# EAGLE board zx80 SD_12 (smd) build006.7(STM32) (EAGLE 9.6.2), part 1 of 2
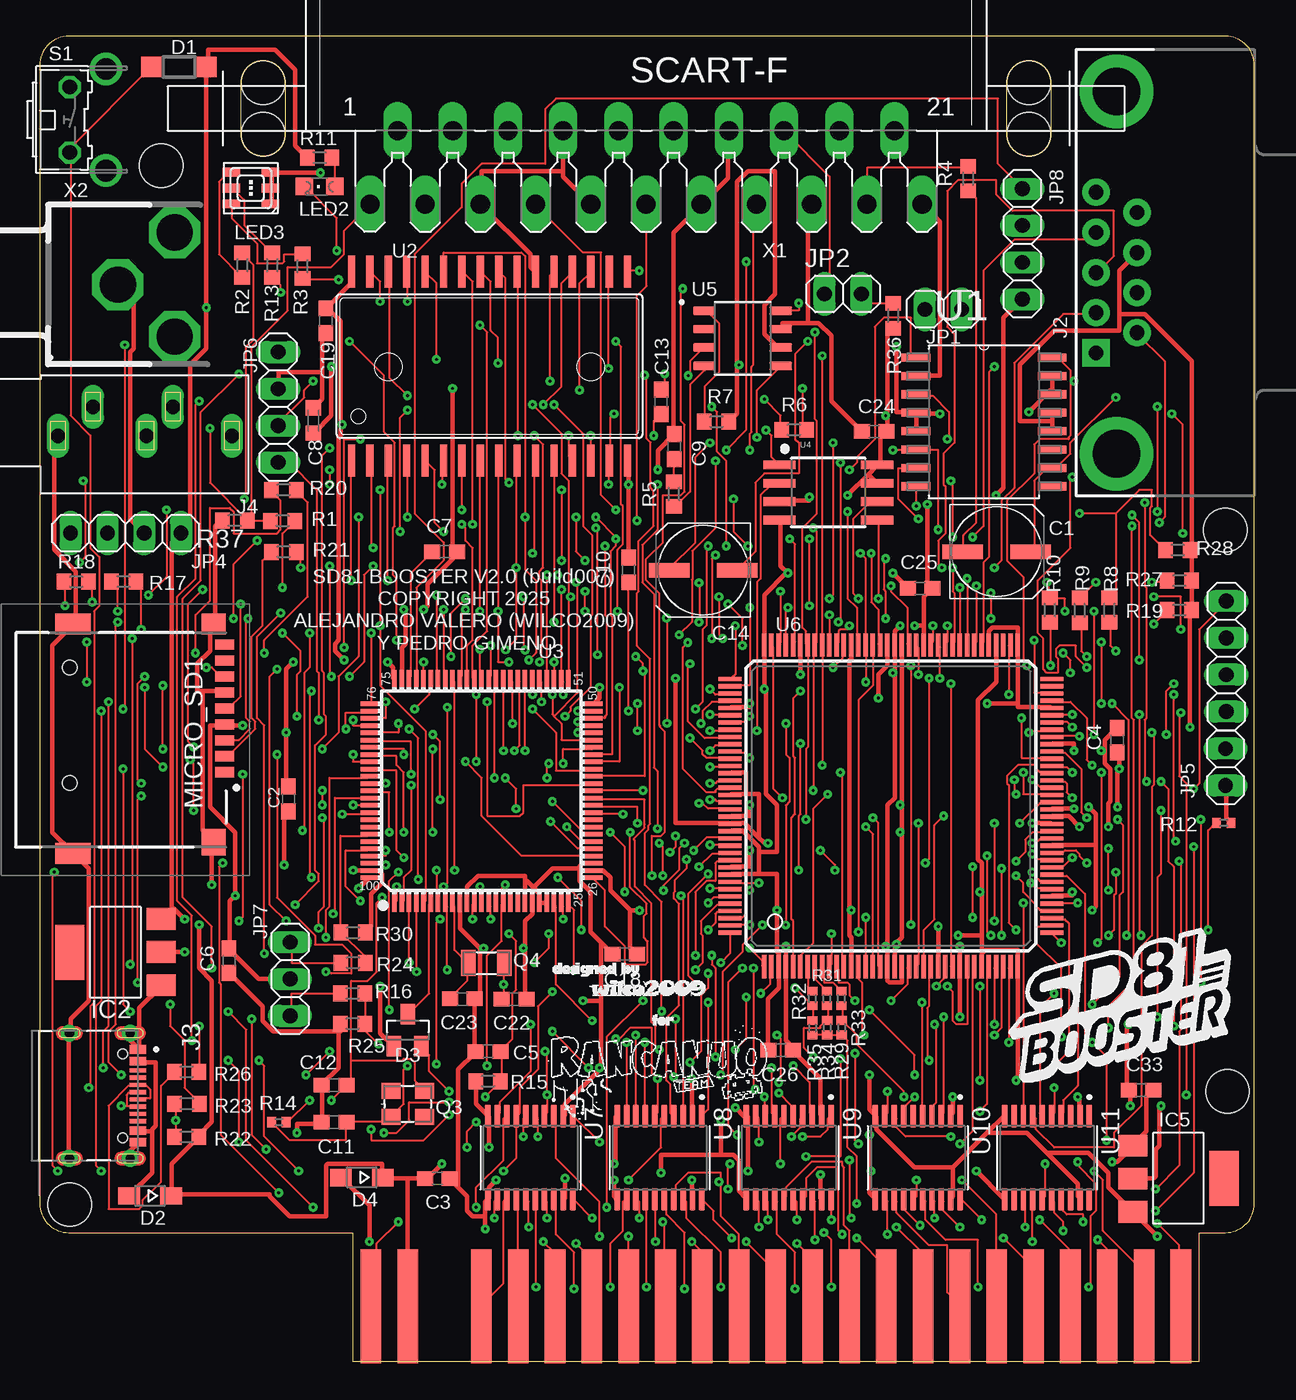
[diagram p3: board, top side]
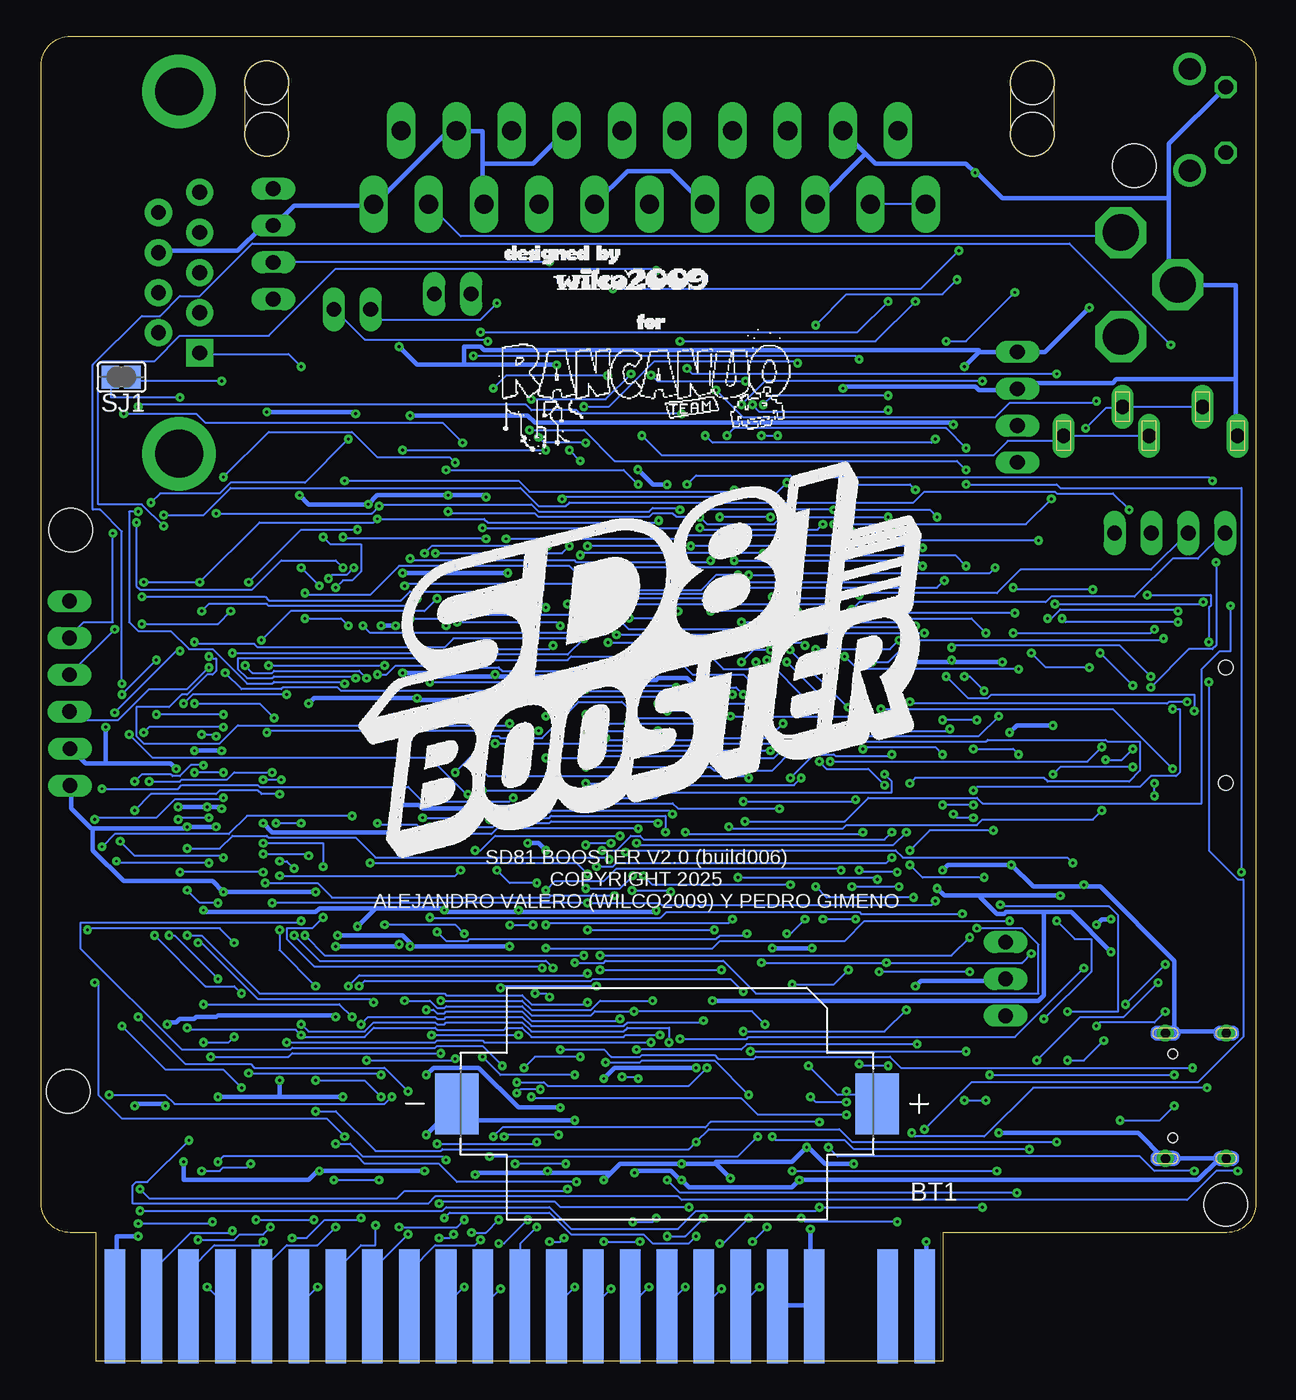
[diagram p4: board, bottom side, seen from below]

Size 83.82 x 91.44 mm. Coordinates in mm from the lower left corner, seen from the top.
Outline: 80.01,8.89 81.82,8.89 arc90 83.82,10.89 83.82,89.44 arc90 81.82,91.44 2,91.44 arc90 0,89.44 0,10.89 arc90 2,8.89 21.59,8.89 21.59,0 80.01,0 80.01,8.89
Copper layers (1*16): Top 0.035mm / dielectric 1.5mm / Bottom 0.035mm
Design rules "default *": minimum track width 5mil, minimum drill 0.2mm, track to track 5mil, track to pad 5mil, pad to pad 5mil, via to via 5mil, smd to smd 5mil, copper to edge 20mil, drill to drill 6mil, minimum pad ring 10mil, minimum via ring 8mil, stop-mask expansion 4mil, vias tented up to drill 999mil, thermal gap 10mil
Net classes: 1 VCC: width 0.3 mm; 2 3,3: width 0.3 mm
Holes 3 mm at 2.09,10.82 8.38,82.51 81.79,57.36 81.96,18.64

## Footprints (pad centres in the part's own frame; a part is rotated, then mirrored left to right if it is on the bottom)
EDGEPIN = smd 1.422 x 7.874: 1 0,0
BAT_CR2032-BS-6-1 = smd 3 x 4.2: N 14.5,0; P -14.5,0
UD-6,3X7,7_NICHICON = smd 2.8 x 1: + 2.35,0; - -2.35,0
C0603 = smd 1.1 x 1: 1 -0.85,0; 2 0.85,0
C0603K = smd 1.05 x 1.08: 1 -0.875,0; 2 0.875,0
SOD123 = smd 1.4 x 1.4: A 1.9,0; C -1.9,0
SOD323-W = smd 1.5 x 1.2: A 1.45,0; C -1.45,0
SOT23 = smd 1 x 1.4: 1 -0.95,-1.1; 2 0.95,-1.1; 3 0,1.1
SOT223 = smd 1.499 x 2.007: 1 -2.261,-3.15; 2 0.025,-3.15; 3 2.311,-3.15 | smd 3.81 x 2.007: 4 0,3.15
DB9_MALE = drill 1.016 pad 1.88 square: 1 5.54,-1.42 | drill 1.016 pad 1.88: 2 2.77,-1.42; 3 0,-1.42; 4 -2.77,-1.42; 5 -5.54,-1.42; 6 4.15,1.42; 7 1.38,1.42; 8 -1.38,1.42; 9 -4.15,1.42 | drill 3.302 pad 5.08: G1 -12.5,0; G2 12.5,0
SHOUHAN_TYPE-C_16PIN_2MD__073_ = smd 0.6 x 1.14: A1_B12 -3.2,3.675; A4_B9 -2.4,3.675; B1_A12 3.2,3.675; B4_A9 2.4,3.675 | smd 0.3 x 1.14: A5 -1.25,3.675; A6 -0.25,3.675; A7 0.25,3.675; A8 1.25,3.675; B5 1.75,3.675; B6 0.75,3.675; B7 -0.75,3.675; B8 -1.75,3.675 | drill 0.65 pad 0.95: SH1 -4.325,3.125; SH2 4.325,3.125; SH3 -4.325,-1.075; SH4 4.325,-1.075 | hole 0.65: -2.89,2.605; 2.89,2.605
XKB_PJ-325C5-G = drill 1 long: 1 0,-0.9; 2 2.4,1.1; 3 7.92,1.1; 4 12,-0.9; 5 6.1,-0.9
1X02 = drill 1.016 long: 1 -1.27,0; 2 1.27,0
1X04 = drill 1.016 long: 1 -3.81,0; 2 -1.27,0; 3 1.27,0; 4 3.81,0
1X03 = drill 1.016 long: 1 -2.54,0; 2 0,0; 3 2.54,0
CHIPLED_0805 = smd 1.2 x 1.2: A 0,-1.05; C 0,1.05
3535-PLCC6 = smd 1.2 x 0.6: P1 1.35,-1.1; P2 1.35,0; P3 1.35,1.1; P4 -1.35,1.1; P5 -1.35,0; P6 -1.35,-1.1
TF-01A = smd 0.7 x 1.3: 1 2.23,7.174; 2 1.13,7.174; 3 0.03,7.174; 4 -1.07,7.174; 5 -2.17,7.174; 6 -3.27,7.174; 7 -4.37,7.174; 8 -5.47,7.174; CD1 -6.57,7.174 | smd 1.448 x 1.651: MP1 -7.989,6.4 | smd 1.448 x 2.438: MP2 -7.989,-3.3; MP3 7.836,-3.3 | smd 1.854 x 1.651: MP4 7.061,6.4 | hole 1: -5.004,-3.531; 2.972,-3.531
3.2X2.5_KX-7 = smd 1.3 x 1.1: 1 -1.15,-0.9; 2 1.15,-0.9; 3 1.15,0.9; 4 -1.15,0.9
3.2X1.5 = smd 1 x 1.8: 1 -1.25,0; 2 1.25,0
R0603 = smd 1 x 1.1: 1 -0.85,0; 2 0.85,0
R0402 = smd 0.6 x 0.7: 1 -0.5,0; 2 0.5,0
B3F-31XX = drill 1.016 octagon: 1 -2.261,-1.245; 2 2.261,-1.245 | drill 1.499 pad 2.159: 3 -3.505,1.245; 4 3.505,1.245
SJ = smd 1.168 x 1.6: 1 -0.762,0; 2 0.762,0
SOIC127P1032X265-16N = smd 1.981 x 0.559: 1 -4.699,4.445; 2 -4.699,3.175; 3 -4.699,1.905; 4 -4.699,0.635; 5 -4.699,-0.635; 6 -4.699,-1.905; 7 -4.699,-3.175; 8 -4.699,-4.445; 9 4.699,-4.445; 10 4.699,-3.175; 11 4.699,-1.905; 12 4.699,-0.635; 13 4.699,0.635; 14 4.699,1.905; 15 4.699,3.175; 16 4.699,4.445
SOP32-5 = smd 2.2 x 0.5: 1 -6.516,9.525; 2 -6.516,8.255; 3 -6.516,6.985; 4 -6.516,5.715; 5 -6.516,4.445; 6 -6.516,3.175; 7 -6.516,1.905; 8 -6.516,0.635; 9 -6.516,-0.635; 10 -6.516,-1.905; 11 -6.516,-3.175; 12 -6.516,-4.445; 13 -6.516,-5.715; 14 -6.516,-6.985; 15 -6.516,-8.255; 16 -6.516,-9.525; 17 6.516,-9.525; 18 6.516,-8.255; 19 6.516,-6.985; 20 6.516,-5.715; 21 6.516,-4.445; 22 6.516,-3.175; 23 6.516,-1.905; 24 6.516,-0.635; 25 6.516,0.635; 26 6.516,1.905; 27 6.516,3.175; 28 6.516,4.445; 29 6.516,5.715; 30 6.516,6.985; 31 6.516,8.255; 32 6.516,9.525
LQFP100-0.5-13.8X13.8MM = smd 1.2 x 0.32: 1 -7.75,6; 2 -7.75,5.5; 3 -7.75,5; 4 -7.75,4.5; 5 -7.75,4; 6 -7.75,3.5; 7 -7.75,3; 8 -7.75,2.5; 9 -7.75,2; 10 -7.75,1.5; 11 -7.75,1; 12 -7.75,0.5; 13 -7.75,0; 14 -7.75,-0.5; 15 -7.75,-1; 16 -7.75,-1.5; 17 -7.75,-2; 18 -7.75,-2.5; 19 -7.75,-3; 20 -7.75,-3.5; 21 -7.75,-4; 22 -7.75,-4.5; 23 -7.75,-5; 24 -7.75,-5.5; 25 -7.75,-6; 51 7.75,-6; 52 7.75,-5.5; 53 7.75,-5; 54 7.75,-4.5; 55 7.75,-4; 56 7.75,-3.5; 57 7.75,-3; 58 7.75,-2.5; 59 7.75,-2; 60 7.75,-1.5; 61 7.75,-1; 62 7.75,-0.5; 63 7.75,0; 64 7.75,0.5; 65 7.75,1; 66 7.75,1.5; 67 7.75,2; 68 7.75,2.5; 69 7.75,3; 70 7.75,3.5; 71 7.75,4; 72 7.75,4.5; 73 7.75,5; 74 7.75,5.5; 75 7.75,6 | smd 0.32 x 1.2: 26 -6,-7.75; 27 -5.5,-7.75; 28 -5,-7.75; 29 -4.5,-7.75; 30 -4,-7.75; 31 -3.5,-7.75; 32 -3,-7.75; 33 -2.5,-7.75; 34 -2,-7.75; 35 -1.5,-7.75; 36 -1,-7.75; 37 -0.5,-7.75; 38 0,-7.75; 39 0.5,-7.75; 40 1,-7.75; 41 1.5,-7.75; 42 2,-7.75; 43 2.5,-7.75; 44 3,-7.75; 45 3.5,-7.75; 46 4,-7.75; 47 4.5,-7.75; 48 5,-7.75; 49 5.5,-7.75; 50 6,-7.75; 76 6,7.75; 77 5.5,7.75; 78 5,7.75; 79 4.5,7.75; 80 4,7.75; 81 3.5,7.75; 82 3,7.75; 83 2.5,7.75; 84 2,7.75; 85 1.5,7.75; 86 1,7.75; 87 0.5,7.75; 88 0,7.75; 89 -0.5,7.75; 90 -1,7.75; 91 -1.5,7.75; 92 -2,7.75; 93 -2.5,7.75; 94 -3,7.75; 95 -3.5,7.75; 96 -4,7.75; 97 -4.5,7.75; 98 -5,7.75; 99 -5.5,7.75; 100 -6,7.75
SO08-EIAJ = smd 0.61 x 2.21: 1 -1.905,-3.378; 2 -0.635,-3.378; 3 0.635,-3.378; 4 1.905,-3.378; 5 1.905,3.353; 6 0.635,3.353; 7 -0.635,3.353; 8 -1.905,3.353
SOIC127P600X170-8N = smd 1.58 x 0.59: 1 -2.625,1.905; 2 -2.625,0.635; 3 -2.625,-0.635; 4 -2.625,-1.905; 5 2.625,-1.905; 6 2.625,-0.635; 7 2.625,0.635; 8 2.625,1.905
TQ144 = smd 1.6 x 0.3: P1 -11.1,8.75; P2 -11.1,8.25; P3 -11.1,7.75; P4 -11.1,7.25; P5 -11.1,6.75; P6 -11.1,6.25; P7 -11.1,5.75; P8 -11.1,5.25; P9 -11.1,4.75; P10 -11.1,4.25; P11 -11.1,3.75; P12 -11.1,3.25; P13 -11.1,2.75; P14 -11.1,2.25; P15 -11.1,1.75; P16 -11.1,1.25; P17 -11.1,0.75; P18 -11.1,0.25; P19 -11.1,-0.25; P20 -11.1,-0.75; P21 -11.1,-1.25; P22 -11.1,-1.75; P23 -11.1,-2.25; P24 -11.1,-2.75; P25 -11.1,-3.25; P26 -11.1,-3.75; P27 -11.1,-4.25; P28 -11.1,-4.75; P29 -11.1,-5.25; P30 -11.1,-5.75; P31 -11.1,-6.25; P32 -11.1,-6.75; P33 -11.1,-7.25; P34 -11.1,-7.75; P35 -11.1,-8.25; P36 -11.1,-8.75; P73 11.1,-8.75; P74 11.1,-8.25; P75 11.1,-7.75; P76 11.1,-7.25; P77 11.1,-6.75; P78 11.1,-6.25; P79 11.1,-5.75; P80 11.1,-5.25; P81 11.1,-4.75; P82 11.1,-4.25; P83 11.1,-3.75; P84 11.1,-3.25; P85 11.1,-2.75; P86 11.1,-2.25; P87 11.1,-1.75; P88 11.1,-1.25; P89 11.1,-0.75; P90 11.1,-0.25; P91 11.1,0.25; P92 11.1,0.75; P93 11.1,1.25; P94 11.1,1.75; P95 11.1,2.25; P96 11.1,2.75; P97 11.1,3.25; P98 11.1,3.75; P99 11.1,4.25; P100 11.1,4.75; P101 11.1,5.25; P102 11.1,5.75; P103 11.1,6.25; P104 11.1,6.75; P105 11.1,7.25; P106 11.1,7.75; P107 11.1,8.25; P108 11.1,8.75 | smd 0.3 x 1.6: P37 -8.75,-11.1; P38 -8.25,-11.1; P39 -7.75,-11.1; P40 -7.25,-11.1; P41 -6.75,-11.1; P42 -6.25,-11.1; P43 -5.75,-11.1; P44 -5.25,-11.1; P45 -4.75,-11.1; P46 -4.25,-11.1; P47 -3.75,-11.1; P48 -3.25,-11.1; P49 -2.75,-11.1; P50 -2.25,-11.1; P51 -1.75,-11.1; P52 -1.25,-11.1; P53 -0.75,-11.1; P54 -0.25,-11.1; P55 0.25,-11.1; P56 0.75,-11.1; P57 1.25,-11.1; P58 1.75,-11.1; P59 2.25,-11.1; P60 2.75,-11.1; P61 3.25,-11.1; P62 3.75,-11.1; P63 4.25,-11.1; P64 4.75,-11.1; P65 5.25,-11.1; P66 5.75,-11.1; P67 6.25,-11.1; P68 6.75,-11.1; P69 7.25,-11.1; P70 7.75,-11.1; P71 8.25,-11.1; P72 8.75,-11.1; P109 8.75,11.1; P110 8.25,11.1; P111 7.75,11.1; P112 7.25,11.1; P113 6.75,11.1; P114 6.25,11.1; P115 5.75,11.1; P116 5.25,11.1; P117 4.75,11.1; P118 4.25,11.1; P119 3.75,11.1; P120 3.25,11.1; P121 2.75,11.1; P122 2.25,11.1; P123 1.75,11.1; P124 1.25,11.1; P125 0.75,11.1; P126 0.25,11.1; P127 -0.25,11.1; P128 -0.75,11.1; P129 -1.25,11.1; P130 -1.75,11.1; P131 -2.25,11.1; P132 -2.75,11.1; P133 -3.25,11.1; P134 -3.75,11.1; P135 -4.25,11.1; P136 -4.75,11.1; P137 -5.25,11.1; P138 -5.75,11.1; P139 -6.25,11.1; P140 -6.75,11.1; P141 -7.25,11.1; P142 -7.75,11.1; P143 -8.25,11.1; P144 -8.75,11.1
SOP65P640X120-20N = smd 1.57 x 0.41: 1 -2.87,2.925; 2 -2.87,2.275; 3 -2.87,1.625; 4 -2.87,0.975; 5 -2.87,0.325; 6 -2.87,-0.325; 7 -2.87,-0.975; 8 -2.87,-1.625; 9 -2.87,-2.275; 10 -2.87,-2.925; 11 2.87,-2.925; 12 2.87,-2.275; 13 2.87,-1.625; 14 2.87,-0.975; 15 2.87,-0.325; 16 2.87,0.325; 17 2.87,0.975; 18 2.87,1.625; 19 2.87,2.275; 20 2.87,2.925
SCART-F = drill 1.321 long: 1 19.05,5.08; 2 17.145,0; 3 15.24,5.08; 4 13.335,0; 5 11.43,5.08; 6 9.525,0; 7 7.62,5.08; 8 5.715,0; 9 3.81,5.08; 10 1.905,0; 11 0,5.08; 12 -1.905,0; 13 -3.81,5.08; 14 -5.715,0; 15 -7.62,5.08; 16 -9.525,0; 17 -11.43,5.08; 18 -13.335,0; 19 -15.24,5.08; 20 -17.145,0; 21 -19.05,5.08 | hole 3.023: 26.416,0.254; 26.416,-3.302; -26.416,0.254; -26.416,-3.302
3P = drill 2.5 pad 3.302 octagon: 1 -0.11,0; 2 3.81,3.595; 2@2 3.81,-3.595

## Placement (x,y rotation side)
1A  D7  [EDGEPIN]  22.86,3.81 0 top
1B  VCC  [EDGEPIN]  22.86,3.81 180 bottom
2A  /RAMCS  [EDGEPIN]  25.4,3.81 0 top
2B  9V  [EDGEPIN]  25.4,3.81 180 bottom
4A  D0  [EDGEPIN]  30.48,3.81 0 top
4B  GND  [EDGEPIN]  30.48,3.81 180 bottom
5A  D1  [EDGEPIN]  33.02,3.81 0 top
5B  GND  [EDGEPIN]  33.02,3.81 180 bottom
6A  D2  [EDGEPIN]  35.56,3.81 0 top
6B  /CLOCK  [EDGEPIN]  35.56,3.81 180 bottom
7A  D6  [EDGEPIN]  38.1,3.81 0 top
7B  A0  [EDGEPIN]  38.1,3.81 180 bottom
8A  D5  [EDGEPIN]  40.64,3.81 0 top
8B  A1  [EDGEPIN]  40.64,3.81 180 bottom
9A  D3  [EDGEPIN]  43.18,3.81 0 top
9B  A2  [EDGEPIN]  43.18,3.81 180 bottom
10A  D4  [EDGEPIN]  45.72,3.81 0 top
10B  A3  [EDGEPIN]  45.72,3.81 180 bottom
11A  A6  [EDGEPIN]  48.26,3.81 0 top
11B  A15  [EDGEPIN]  48.26,3.81 180 bottom
12A  /NMI  [EDGEPIN]  50.8,3.81 0 top
12B  A14  [EDGEPIN]  50.8,3.81 180 bottom
13A  /HALT  [EDGEPIN]  53.34,3.81 0 top
13B  A13  [EDGEPIN]  53.34,3.81 180 bottom
14A  /MREQ  [EDGEPIN]  55.88,3.81 0 top
14B  A12  [EDGEPIN]  55.88,3.81 180 bottom
15A  /IORQ  [EDGEPIN]  58.42,3.81 0 top
15B  A11  [EDGEPIN]  58.42,3.81 180 bottom
16A  /RD  [EDGEPIN]  60.96,3.81 0 top
16B  A10  [EDGEPIN]  60.96,3.81 180 bottom
17A  /WR  [EDGEPIN]  63.5,3.81 0 top
17B  A9  [EDGEPIN]  63.5,3.81 180 bottom
18A  /BUSAK  [EDGEPIN]  66.04,3.81 0 top
18B  A8  [EDGEPIN]  66.04,3.81 180 bottom
19A  /WAIT  [EDGEPIN]  68.58,3.81 0 top
19B  A7  [EDGEPIN]  68.58,3.81 180 bottom
20A  /BUSRQ  [EDGEPIN]  71.12,3.81 0 top
20B  A6  [EDGEPIN]  71.12,3.81 180 bottom
21A  /RESET  [EDGEPIN]  73.66,3.81 0 top
21B  A5  [EDGEPIN]  73.66,3.81 180 bottom
22A  /M1  [EDGEPIN]  76.2,3.81 0 top
22B  A4  [EDGEPIN]  76.2,3.81 180 bottom
23A  /RFSH  [EDGEPIN]  78.74,3.81 0 top
23B  /ROMCS  [EDGEPIN]  78.74,3.81 180 bottom
BT1  CR2032-BS-6-1  [BAT_CR2032-BS-6-1]  40.64,17.78 180 bottom
C1  220uF  [UD-6,3X7,7_NICHICON]  66.04,55.88 0 top
C2  100nF  [C0603]  17.17,38.81 270 top
C3  10uF  [C0603]  27.45,12.63 0 top
C4  100nF  [C0603]  74.34,42.86 90 top
C5  22pF  [C0603]  30.94,21.39 0 top
C6  10uF  [C0603]  13.07,27.66 270 top
C7  10uF  [C0603]  27.94,55.88 0 top
C8  100nF  [C0603K]  18.88,64.92 270 top
C9  1uF  [C0603]  43.78,63.12 270 top
C10  10uF  [C0603]  40.64,54.61 90 top
C11  22pF  [C0603]  20.32,16.51 0 top
C12  22pF  [C0603]  20.32,19.05 0 top
C13  1uF  [C0603]  42.87,66.22 90 top
C14  470uF  [UD-6,3X7,7_NICHICON]  45.79,54.6 180 top
C18  100nF  [C0603]  40.37,28.11 0 top
C19  100nF  [C0603]  19.75,71.81 270 top
C22  22pF  [C0603]  32.73,25 180 top
C23  22pF  [C0603]  29.16,25.02 180 top
C24  0.1uF  [C0603]  57.58,64.17 180 top
C25  0.1uF  [C0603]  60.76,53.34 180 top
C26  100nF  [C0603]  51.13,21.49 180 top
C33  10uF  [C0603]  76,18.71 0 top
D1  1n4148  [SOD123]  9.62,89.32 180 top
D2  1n5819  [SOD323-W]  7.62,11.43 180 top
D3  BAT54C  [SOT23]  25.4,22.86 0 top
D4  1n5819  [SOD323-W]  22.23,12.7 180 top
IC2  REG1117  [SOT223]  5.23,28.23 90 top
IC5  1.2V  [SOT223]  78.57,12.64 270 top
J2  JOYSTICK  [DB9_MALE]  74.31,75.13 270 top
J3  TYPE-C_16PIN_2MD__073_  [SHOUHAN_TYPE-C_16PIN_2MD__073_]  3.12,18.33 270 top
J4  PJ-325C5-G  [XKB_PJ-325C5-G]  1.27,64.77 0 top
JP1  SPEAKER  [1X02]  62.35,72.6 0 top
JP2  [1X02]  55.43,73.67 0 top
JP3  JTAG  [1X04]  81.88,48.65 90 top
JP4  SERIAL  [1X04]  5.94,57.16 180 top
JP5  VREF  [1X02]  81.83,41.01 90 top
JP6  PS2  [1X04]  16.46,65.84 270 top
JP7  BOOT  [1X03]  17.28,26.39 270 top
JP8  ST-LINK-V2  [1X04]  67.81,77.11 270 top
LED2  SD  [CHIPLED_0805]  19.33,81.06 90 top
LED3  STATUS  [3535-PLCC6]  14.57,80.96 0 top
MICRO_SD1  TF-01A  [TF-01A]  5.6,42.89 270 top
Q3  8MHz  [3.2X2.5_KX-7]  25.4,17.78 0 top
Q4  32767Hz  [3.2X1.5]  30.82,27.49 0 top
R1  300R  [R0603]  16.75,58 0 top
R2  150  [R0603]  13.98,75.64 270 top
R3  68  [R0603]  18.13,75.59 90 top
R4  75R  [R0603]  64.07,81.62 270 top
R5  100R  [R0603]  43.76,59.86 90 top
R6  100R  [R0603]  52.06,64.28 180 top
R7  10K  [R0603]  46.71,64.84 0 top
R8  270  [R0603]  73.8,51.86 270 top
R9  270  [R0603]  71.76,51.83 270 top
R10  270  [R0603]  69.69,51.85 270 top
R11  680  [R0603]  19.31,83.06 0 top
R12  2K  [R0402]  81.71,37.16 180 top
R13  150  [R0603]  16.05,75.63 90 top
R14  1M  [R0402]  16.51,16.51 0 top
R15  3k3  [R0603]  30.94,19.34 180 top
R16  510  [R0603]  21.59,25.4 0 top
R17  3k3  [R0603]  5.79,53.81 180 top
R18  3k3  [R0603]  2.52,53.8 0 top
R19  75R  [R0603]  78.63,51.84 0 top
R20  3k3  [R0603]  16.85,60.14 0 top
R21  3k3  [R0603]  16.85,55.86 180 top
R22  1K5  [R0603]  10.14,15.5 0 top
R23  22R  [R0603]  10.16,17.78 0 top
R24  510  [R0603]  21.63,27.51 180 top
R25  10K  [R0603]  21.6,23.3 0 top
R26  22R  [R0603]  10.13,19.98 0 top
R27  75R  [R0603]  78.63,53.88 0 top
R28  75R  [R0603]  78.54,55.98 0 top
R29  1K  [R0402]  55.32,25.04 270 top
R30  10K  [R0603]  21.63,29.59 180 top
R31  1K  [R0402]  54.32,25.04 270 top
R32  1K  [R0402]  53.32,25.04 270 top
R33  2K  [R0402]  55.34,23.03 90 top
R34  2K  [R0402]  54.34,23.03 90 top
R35  2K  [R0402]  53.33,23.01 90 top
R36  100R  [R0603]  58.89,72.15 270 top
R37  100R  [R0603]  13.47,58.03 180 top
S1  RESET  [B3F-31XX]  3.32,85.67 270 top
SJ1  [SJ]  78.28,67.92 180 bottom
U1  AD724  [SOIC127P1032X265-16N]  65.16,64.83 0 top
U2  AS6C4008  [SOP32-5]  31.04,68.68 90 top
U3  MCU-STM32F407VET6(LQFP100)  [LQFP100-0.5-13.8X13.8MM]  30.48,39.37 90 top
U4  25F32006WSOI  [SO08-EIAJ]  54.44,59.96 270 top
U5  PAM8302  [SOIC127P600X170-8N]  48.5,70.59 0 top
U6  XC6SLX9-2TQG144C  [TQ144]  58.74,38.34 90 top
U7  TXS0108EPWR  [SOP65P640X120-20N]  33.86,14.05 270 top
U8  TXS0108EPWR  [SOP65P640X120-20N]  42.77,14.05 270 top
U9  TXS0108EPWR  [SOP65P640X120-20N]  51.68,14.05 270 top
U10  TXS0108EPWR  [SOP65P640X120-20N]  60.59,14.05 270 top
U11  TXS0108EPWR  [SOP65P640X120-20N]  69.5,14.05 270 top
X1  SCART-F  [SCART-F]  41.84,84.93 180 top
X2  CON-CONRAD_736880-2P  [3P]  5.51,74.3 0 top

## Tracks (layer width: path | path; a pad name or v marks a point on that pad's centre or on a via)
1V2  (via drill 0.2)
  Top 0.3: v75.25,17.64 75.25,18.64 C33.1 75.12,18.77 75,18.77 75,23.14 v75.12,23.27 | v77.38,17.64 77.25,17.52 77.25,14.89 77,14.64 77,12.77 76.88,12.64 75.5,12.64 IC5.2 | 59.5,36.52 59.5,29.27 59.06,28.83 | 59.5,36.52 59.5,38.39 | 59.5,38.39 59.5,49.39 U6.P89 | 59.06,28.83 59,28.77 59,27.27 U6.P19 | v49,38.39 49,37.64 47.75,37.64 U6.P128 | v59.38,38.39 59.5,38.39 | v63.5,28.64 63.5,27.27 U6.P28 63.5,27.14 v63.5,23.77 | v59.12,28.77 59.06,28.83 | v68.5,37.14 69.75,37.14 U6.P52 | v59.38,36.52 59.5,36.52
  Bottom 0.3: v75.25,17.64 75.38,17.77 77.25,17.77 v77.38,17.64 | v49,38.39 49.12,38.27 54.25,38.27 54.38,38.14 57.5,38.14 57.75,38.39 v59.38,38.39 | v63.5,28.64 59.25,28.64 v59.12,28.77 | v68.5,37.14 67.88,36.52 v59.38,36.52 | v75.12,23.27 75,23.39 74.5,23.39 74.25,23.64 73.25,23.64 73.12,23.77 71.75,23.77 71.62,23.89 63.62,23.89 v63.5,23.77
3V3  (via drill 0.2)
  Top 0.3: U3.22 34.88,31.64 34.5,31.64 U3.21 34.5,31.77 34.5,32.27 34.06,32.7 | 33.5,33.14 33.5,31.64 U3.19 | 33.5,33.14 33.5,33.52 30.25,33.52 29.5,32.77 29.5,31.64 U3.11 | 34.06,32.7 33.62,33.14 33.5,33.14 | 38.81,28.83 38,29.64 38,32.39 37.25,33.14 37.25,34.02 | 38.81,28.83 39.5,28.14 C18.1 | 37.25,34.02 37.25,34.14 37.5,34.39 38.12,34.39 U3.28 | 38.69,20.2 38.75,20.27 38.75,24.89 | 38.69,20.2 36.25,17.77 36.25,17.02 U7.2 | 38.75,24.89 38.75,28.77 38.81,28.83 | v45,19.52 45,17.02 U8.2 | v38.62,20.27 38.69,20.2 | 34.06,32.7 35.38,34.02 37.25,34.02 | 20.75,64.64 20.75,63.89 20.62,63.77 20.62,49.77 20.38,49.52 20.38,49.02 v21,48.39 | 20.75,64.64 20.75,71.77 19.88,72.64 C19.1 21.52,74.42 U2.32 | v24,48.27 24.38,47.89 24.38,47.14 U3.75 | v14,43.89 12.88,43.89 MICRO_SD1.4 12.75,43.89 11.75,43.89 11.75,38.27 13.5,36.52 v13.5,32.14 13.12,31.77 13.12,28.64 C6.1 13.12,28.39 15.12,26.39 17.25,26.39 JP7.2 | C2.1 17.12,39.77 17,39.89 v17,43.39 17,47.77 v17.5,48.27 | v22,32.64 U3.100 | v23.5,25.89 23.5,22.64 24.38,21.77 D3.1 | v10,28.27 8.5,28.27 IC2.2 | v37.5,24.89 38.75,24.89 | R12.1 82.12,37.27 81.88,37.52 81.88,39.64 JP5.1 | 73.5,42.14 73.5,41.27 73.88,40.89 73.88,38.64 73.75,38.52 v73.75,36.89 | 73.5,42.14 73.5,42.89 74.25,43.64 C4.2 | v71.25,32.39 71.25,32.14 69.88,32.14 U6.P42 | v71.75,36.89 71,37.64 69.88,37.64 U6.P53 | v71.38,42.14 71.38,42.64 69.88,42.64 U6.P63 | v73.25,42.14 73.5,42.14 | v63,18.27 63,17.14 62.88,17.02 U10.2 | v71.62,18.27 71.75,18.14 71.75,17.02 U11.2 | 65,28.14 65,27.27 U6.P31 | 65,28.14 65.25,28.39 67.5,28.39 67.5,27.27 U6.P36 67.5,27.14 67.5,19.52 v67.38,19.39 | 65,28.14 65,29.39
  Top 0.3: 65,29.39 65,32.39 | 65,32.39 65,34.39 64.75,34.64 64.75,45.64 66,46.89 66,49.39 U6.P76 | v64.88,32.39 65,32.39 | 61,50.77 61,49.52 U6.P86 | 61,50.77 61,52.77 61.5,53.27 C25.1 61.5,53.39 61.25,53.64 v61.25,59.14 | 58.5,65.27 58.5,64.27 C24.1 58.38,64.14 58,63.77 58,62.02 57.88,61.89 U4.8 57.75,61.77 57.19,61.2 | 58.5,65.27 58.5,70.89 58.88,71.27 R36.2 | v53.12,59.64 53.12,59.39 51.12,59.39 U4.3 | 57.19,61.2 v55.75,59.77 | 57.19,61.2 57.75,60.64 U4.7 | v66,59.77 66.5,60.27 66.5,72.02 67.75,73.27 JP8.4 | v49,35.27 49,34.14 47.75,34.14 U6.P135 | v50.25,35.77 50,35.77 49.56,36.2 | 49.56,36.2 48.62,37.14 47.75,37.14 U6.P129 47.5,37.14 43.88,37.14 v43.88,47.14 | 48.75,39.14 49.62,39.14 49.62,36.27 49.56,36.2 | 48.75,39.14 47.75,39.14 U6.P125 | 48.75,39.14 48.75,40.64 47.75,40.64 U6.P122 | U3.50 38.62,45.77 v38.62,46.52 | v52.5,47.39 52.5,49.39 U6.P103 | U9.2 53.88,17.02 53.88,19.52 52,21.39 C26.1 52,21.64 51.5,22.14 51.5,27.14 U6.P4 51.5,27.39 v51.5,28.64 | U6.P20 59.5,27.14 59.5,26.14 58.62,26.14 58.5,26.27 58.5,27.14 U6.P18 58.5,27.39 58.5,28.64 | 59,47.52 59,38.89 58.5,38.39 58.5,28.64 | 59,47.52 59,49.39 U6.P90 59,49.52 59,50.39 v59.38,50.77 | v58.38,28.64 58.5,28.64 | v58.88,47.52 59,47.52 | v60.38,50.77 61,50.77 | v63.38,29.39 65,29.39 | v20.88,64.64 20.75,64.64 | v58.38,65.27 58.5,65.27
  Bottom 0.3: v45,19.52 44.25,20.27 v38.62,20.27 | v24,48.27 21.12,48.27 v21,48.39 20.88,48.39 20.75,48.27 v17.5,48.27 | v17,43.39 16.5,43.89 v14,43.89 | v22,32.64 21.5,32.14 19,32.14 | v13.5,32.14 19,32.14 | v23.5,25.89 23.12,26.27 17.38,26.27 JP7.2 | v10,28.27 12.75,31.02 14.62,31.02 | 14.62,31.02 17.25,31.02 17.38,30.89 17.88,30.89 19,32.02 19,32.14 | v37.5,24.89 15,24.89 14.62,25.27 14.62,31.02 | 80.25,36.77 80.38,36.77 81.75,38.14 81.75,39.64 JP5.1 | 80.25,36.77 73.88,36.77 v73.75,36.89 v71.75,36.89 | 80.25,36.77 80.25,35.27 78.12,33.14 72,33.14 v71.25,32.39 v64.88,32.39 | v73.25,42.14 v71.38,42.14 | v71.62,18.27 67.38,18.27 | 67.38,18.27 v63,18.27 | v67.38,19.39 67.38,18.27 | v53.12,59.64 53.25,59.77 v55.75,59.77 60.62,59.77 v61.25,59.14 65.38,59.14 v66,59.77 | v49,35.27 49.5,35.77 v50.25,35.77 | v38.62,46.52 39.25,47.14 41.25,47.14 41.38,47.02 43.88,47.02 | 43.88,47.02 45.62,47.02 45.88,47.27 52.38,47.27 v52.5,47.39 52.62,47.39 52.75,47.27 56.5,47.27 56.75,47.52 v58.88,47.52 | v43.88,47.14 43.88,47.02 | v51.5,28.64 v58.38,28.64 58.25,28.77 58.88,29.39 v63.38,29.39 | v59.38,50.77 v60.38,50.77 | v20.88,64.64 21,64.77 49.75,64.77 50.25,65.27 v58.38,65.27
/BUSAK_5  (via drill 0.2)
  Top 0.127: v60.5,12.52 60.5,11.39 60.38,11.27 U10.15 | v63.62,12.52 66,10.14 66,3.89 18A.1
  Bottom 0.127: v63.62,12.52 v60.5,12.52
/BUSRQ_5  (via drill 0.2)
  Top 0.127: v65,9.77 63.62,11.14 U10.20 | v69,9.77 71,7.77 71,3.89 20A.1
  Bottom 0.127: v69,9.77 v65,9.77
/CLOCK  (via drill 0.2)
  Top 0.127: v34.38,15.52 34.38,16.77 34.25,16.89 U7.5 | v52.88,14.14 55.25,14.14 v55.25,20.89 | v61.38,20.77 61.25,20.89 61.25,24.39 61.38,24.52 61.38,27.14 U6.P24
  Bottom 0.127: v34.38,15.52 35.75,14.14 v52.88,14.14 | v55.25,20.89 55.38,20.77 v61.38,20.77
/CLOCK_5  (via drill 0.2)
  Top 0.127: v34.25,5.14 34.25,11.14 U7.16
  Bottom 0.127: v34.25,5.14 35.5,3.89 6B.1
/HALT  (via drill 0.2)
  Top 0.127: v50,18.27 50,17.02 U9.8 | v28.25,17.02 26.5,15.27 22.88,15.27 v22.88,16.02 | v3.25,49.64 v3.25,46.89 | v7.5,52.89 8.75,54.14 v8.75,58.77 | v75.38,58.39 75.88,57.89 v75.88,48.39 | v78.25,46.02 78.25,36.02 v78.38,35.89 | v71.25,34.77 70.62,34.14 69.88,34.14 U6.P46
  Bottom 0.127: v50,18.27 49.88,18.14 35.5,18.14 34.38,17.02 v28.25,17.02 | v22.88,16.02 19.62,19.27 4,19.27 0.88,22.39 0.88,33.27 1.25,33.27 3.25,35.27 v3.25,46.89 | v3.25,49.64 3.25,52.02 3.12,52.14 3.12,52.89 v7.5,52.89 | v8.75,58.77 9.88,59.89 13.75,59.89 13.88,60.02 22.88,60.02 23.62,59.27 47.38,59.27 47.62,59.02 49.5,59.02 50.75,60.27 70.75,60.27 72.62,58.39 v75.38,58.39 | v78.25,46.02 v75.88,48.39 | v78.38,35.89 77.38,34.89 71.38,34.89 v71.25,34.77
/HALT_5  (via drill 0.2)
  Top 0.127: v50.25,9.77 50.25,11.02 50.12,11.14 U9.13 | v52.25,8.14 53.25,7.14 53.25,3.89 13A.1
  Bottom 0.127: v50.25,9.77 51.88,8.14 v52.25,8.14
/IORQ  (via drill 0.2)
  Top 0.127: v51.88,15.52 52.5,16.14 52.5,16.77 52.62,16.89 U9.4 | v48.12,15.64 47.5,16.27 47.5,26.14 v48.5,27.14 | v66.38,34.02 v66.38,29.39 | v67.38,34.52 68,35.14 68,36.02 68.5,36.52 69.75,36.52 U6.P51
  Bottom 0.127: v51.88,15.52 51.75,15.64 v48.12,15.64 | v48.5,27.14 49,27.64 64.62,27.64 v66.38,29.39 | v66.38,34.02 66.88,34.52 v67.38,34.52
/IORQ_5  (via drill 0.2)
  Top 0.127: v55.38,8.77 55.12,9.02 55.12,13.39 53.62,13.39 52.88,12.64 52.88,11.39 52.75,11.27 U9.17 | v56.38,8.52 58.38,6.52 58.38,3.89 15A.1
  Bottom 0.127: v55.38,8.77 55.62,8.52 v56.38,8.52
/M1  (via drill 0.2)
  Top 0.127: v70,25.39 69,24.39 69,17.14 69.12,17.02 U11.6 | v76,29.39 75.88,29.52 v75.88,44.64 | v71.25,44.64 69.88,44.64 U6.P67
  Bottom 0.127: v70,25.39 70.5,25.89 72.5,25.89 v76,29.39 | v71.25,44.64 v75.88,44.64
/M1_5  (via drill 0.2)
  Top 0.127: v69.38,13.64 69.38,11.39 69.25,11.27 U11.15 | v72.75,13.14 73.38,12.52 73.38,9.02 76.12,6.27 76.12,3.89 22A.1
  Bottom 0.127: v69.38,13.64 69.62,13.39 71.25,13.39 71.5,13.14 v72.75,13.14
/MEM_OE  (via drill 0.2)
  Top 0.127: v57.38,55.77 57.38,52.39 57.88,51.89 57.88,49.52 U6.P92 | v48.88,56.27 47.88,57.27 v47.88,59.52 | v32.38,60.64 32.12,60.89 32.12,74.77 31.75,75.14 U2.24
  Bottom 0.127: v57.38,55.77 56.88,56.27 v48.88,56.27 | v47.88,59.52 47.75,59.64 33.38,59.64 v32.38,60.64
/MREQ  (via drill 0.2)
  Top 0.127: v51.12,13.64 51.12,16.77 51.25,16.89 U9.6 | v47.62,13.64 47.5,13.52 v47.5,11.89 | v77,11.89 78.62,13.52 78.62,22.77 78.75,22.89 78.75,34.39 v78.62,34.52 | v72.25,34.39 71.75,34.89 71.75,35.02 71.5,35.27 70.75,35.27 70.62,35.14 69.88,35.14 U6.P48
  Bottom 0.127: v47.62,13.64 v51.12,13.64 | v47.5,11.89 47.62,11.77 58.75,11.77 59.25,11.27 76.38,11.27 v77,11.89 | v78.62,34.52 78.5,34.39 v72.25,34.39
/MREQ_5
  Top 0.127: U9.15 51.38,11.27 51.5,11.39 51.5,12.02 53.25,13.77 55.38,13.77 55.38,13.52 55.5,13.39 55.5,9.39 55.88,9.02 55.88,3.89 14A.1
/NMI  (via drill 0.2)
  Top 0.127: v46.12,24.77 46.12,17.39 45.75,17.02 U8.1 | v73.75,29.39 74.12,29.77 74.12,32.14 74.25,32.27 v74.25,33.77 | v68.5,33.77 68.75,33.52 68.75,33.39 69,33.14 69.75,33.14 U6.P44
  Bottom 0.127: v46.12,24.77 46.25,24.64 50,24.64 50.62,25.27 55.88,25.27 56,25.39 68.75,25.39 72.75,29.39 v73.75,29.39 | v68.5,33.77 v74.25,33.77
/NMI_5  (via drill 0.2)
  Top 0.127: v47.75,8.52 46.5,9.77 46.5,10.39 45.75,11.14 U8.20 | v48.75,8.27 50.75,6.27 50.75,3.89 12A.1
  Bottom 0.127: v47.75,8.52 48,8.27 v48.75,8.27
/OE_OL  (via drill 0.2)
  Top 0.127: v37.12,44.14 37.12,43.89 38.12,43.89 U3.47 | v55.25,40.64 55.38,40.52 55.38,27.27 U6.P12
  Bottom 0.127: v37.12,44.14 37.38,44.39 42.62,44.39 43.75,45.52 46.75,45.52 49.25,43.02 52.12,43.02 52.25,43.14 52.75,43.14 v55.25,40.64
/RD  (via drill 0.2)
  Top 0.127: v52.62,15.52 53.88,15.52 54.38,16.02 54.38,16.77 54.5,16.89 U9.1 | v30.12,16.52 29.5,15.89 v29.5,14.77 | v4.25,13.14 3.88,13.52 3.88,24.52 4.25,24.89 v4.25,44.89 | v21.38,47.27 22.38,48.27 22.38,54.27 v23,54.89 | v36,60.14 v36,55.27 | v62.88,60.77 63,60.64 v63,56.89 | v53.12,52.14 v53.12,56.77 | v51.62,52.02 51.5,51.89 51.5,49.52 U6.P105
  Bottom 0.127: v52.62,15.52 52,16.14 38,16.14 37.62,16.52 v30.12,16.52 | v29.5,14.77 28.88,14.14 8,14.14 7,13.14 v4.25,13.14 | v4.25,44.89 4.25,46.02 18.25,46.02 18.5,45.77 19.88,45.77 v21.38,47.27 | v23,54.89 23.38,55.27 v36,55.27 | v36,60.14 36.12,60.02 50.12,60.02 50.88,60.77 v62.88,60.77 | v63,56.89 62.88,56.77 v53.12,56.77 | v53.12,52.14 53,52.02 v51.62,52.02
/RD_5  (via drill 0.2)
  Top 0.127: v54.62,9.77 54.62,11.14 U9.20 | v59.12,9.27 60.88,7.52 60.88,3.89 16A.1
  Bottom 0.127: v54.62,9.77 55.12,9.27 v59.12,9.27
/RESET  (via drill 0.2)
  Top 0.127: v22.12,31.77 21.12,32.77 21.12,35.27 22.62,35.27 U3.96 | v46.12,31.64 46.5,32.02 47.62,32.02 U6.P139 | v67.88,31.64 67.88,17.02 U11.8
  Bottom 0.127: v22.12,31.77 22.38,31.52 41.02,31.52 41.15,31.64 v46.12,31.64 v67.88,31.64
/RESET_5  (via drill 0.2)
  Top 0.127: v68,9.27 68,11.14 U11.13 | v73,8.39 73.62,7.77 73.62,3.89 21A.1
  Bottom 0.127: v68,9.27 68.5,8.77 70.12,8.77 70.5,8.39 v73,8.39
/RFSH  (via drill 0.2)
  Top 0.127: v71.62,26.39 71.62,19.02 70.62,18.02 70.62,17.14 70.5,17.02 U11.4 | v75,29.39 75.12,29.52 75.12,44.27 v74,45.39 | v66.88,46.02 66.88,49.39 U6.P74
  Bottom 0.127: v71.62,26.39 74.62,29.39 v75,29.39 | v74,45.39 73.38,46.02 v66.88,46.02
/RFSH_5  (via drill 0.2)
  Top 0.127: v72,9.64 72,10.14 70.88,10.14 70.62,10.39 70.62,11.02 70.5,11.14 U11.17 | v77.12,9.52 78.62,8.02 78.62,3.89 23A.1
  Bottom 0.127: v72,9.64 72.12,9.52 v77.12,9.52
/WAIT  (via drill 0.2)
  Top 0.127: v38.12,23.52 35.62,26.02 35.62,31.39 35.5,31.52 U3.23 | v61.75,23.27 61.88,23.14 61.88,17.89 61.62,17.64 61.62,17.02 U10.4
  Bottom 0.127: v38.12,23.52 38.25,23.39 43.38,23.39 43.62,23.14 50,23.14 50.62,23.77 55.88,23.77 56,23.64 56.5,23.64 56.62,23.77 61.25,23.77 v61.75,23.27
/WAIT_5  (via drill 0.2)
  Top 0.127: v61.75,9.89 61.75,11.02 61.62,11.14 U10.17 | v66.5,8.52 68.5,6.52 68.5,3.89 19A.1
  Bottom 0.127: v61.75,9.89 61.88,9.77 64.25,9.77 65.5,8.52 v66.5,8.52
/WR  (via drill 0.2)
  Top 0.127: v62.88,15.52 59.75,15.52 59.12,16.14 59.12,16.77 59,16.89 U10.8 | v80.12,37.39 v80.12,26.14 | v71.25,38.89 70.88,39.27 70.88,39.89 70.75,40.02 69.88,40.02 U6.P58
  Bottom 0.127: v62.88,15.52 64.12,16.77 78.25,16.77 79.88,18.39 79.88,26.14 v80.12,26.14 | v80.12,37.39 80,37.52 75.88,37.52 74.62,38.77 71.38,38.77 v71.25,38.89
/WR'  (via drill 0.2)
  Top 0.127: v52.88,37.39 52.88,42.27 53,42.39 53,49.39 U6.P102 52.88,49.52 52.88,50.39 52.62,50.64 52.62,57.52 53.62,58.52 53.62,64.89 53.5,65.02 v53.5,71.02 | U3.26 38.25,33.27 39,32.52 39,30.02 40.38,28.64 40.38,27.52 40.5,27.39 41.81,27.39 41.96,27.53 41.96,28.99 41.69,29.25 41.69,30.73 41.88,30.91 41.88,31.59 40.75,32.71 v40.75,36.52 | v25.38,73.14 25.38,75.14 U2.29
  Bottom 0.127: v40.75,36.52 40.75,37.64 48.62,37.64 48.75,37.52 52.75,37.52 v52.88,37.39 | v25.38,73.14 27.5,71.02 v53.5,71.02
/WR_5
  Top 0.127: U10.13 59,11.14 59.12,11.02 59.12,10.27 61.38,8.02 62.62,8.02 62.62,4.77 63.5,3.89 17A.1
A0  (via drill 0.2)
  Top 0.127: v38.62,8.64 38.62,11.02 35.62,14.02 35.62,16.77 35.5,16.89 U7.3 | v56,9.89 55.88,10.02 v55.88,13.89 | v63.5,15.02 64.38,15.89 64.38,27.14 U6.P30
  Bottom 0.127: v38.62,8.64 39.12,8.14 41.62,8.14 42.25,8.77 47.25,8.77 48.75,10.27 55.62,10.27 v56,9.89 | v55.88,13.89 56.12,14.14 61.62,14.14 62.5,15.02 v63.5,15.02
A0'  (via drill 0.2)
  Top 0.127: v23.88,35.27 23.88,34.89 22.75,34.89 U3.97 | v18.12,36.64 18.25,36.77 18.25,47.52 18.62,47.89 v18.62,50.27 | 35.5,54.27 35.5,62.14 U2.12 | 35.5,54.27 v35.5,51.02 | v62.62,50.77 62.62,49.64 62.5,49.52 U6.P83 | v65.62,53.02 v65.62,51.27 | 35.5,54.27 v35.75,54.27
  Bottom 0.127: v23.88,35.27 22.5,36.64 v18.12,36.64 | v18.62,50.27 19.62,51.27 24.12,51.27 24.38,51.02 v35.5,51.02 | v62.62,50.77 63.12,51.27 v65.62,51.27 | v65.62,53.02 65.5,52.89 61.12,52.89 59.12,54.89 47.37,54.89 45.69,53.21 38.31,53.21 37.25,54.27 v35.75,54.27
A0_5  (via drill 0.2)
  Top 0.127: v36.88,5.02 36.88,7.52 35.62,8.77 35.62,11.02 35.5,11.14 U7.18
  Bottom 0.127: v36.88,5.02 38,3.89 7B.1
A1  (via drill 0.2)
  Top 0.127: v40.5,22.02 40.5,17.02 U8.9 | v65.88,23.27 65.88,27.14 U6.P33
  Bottom 0.127: v40.5,22.02 40.5,23.02 43.38,23.02 43.62,22.77 50,22.77 50.62,23.39 55.88,23.39 56,23.27 56.5,23.27 56.62,23.39 60.88,23.39 61.5,22.77 65.38,22.77 v65.88,23.27
A1'  (via drill 0.2)
  Top 0.127: v23.88,34.27 22.75,34.27 U3.98 | v18.75,33.39 18.62,33.52 18.62,46.14 v18.75,46.27 | v20.12,47.27 20,47.39 v20,54.89 | v34,55.77 34.12,55.89 34.12,62.14 U2.11 | v62.12,47.14 62.12,49.27 62,49.39 U6.P84 | v46.38,49.89 46.38,55.39 v46.62,55.64
  Bottom 0.127: v23.88,34.27 23,33.39 v18.75,33.39 | v18.75,46.27 19.75,47.27 v20.12,47.27 | v20,54.89 20.75,55.64 33.88,55.64 v34,55.77 46.5,55.77 v46.62,55.64 | v62.12,47.14 62.25,47.27 67.75,47.27 67.88,47.14 69.62,47.14 70.25,47.77 70.25,48.52 56,48.52 55.75,48.77 47.5,48.77 v46.38,49.89
A1_5  (via drill 0.2)
  Top 0.127: v39.38,5.14 39.38,8.14 40.25,9.02 40.25,11.02 40.38,11.14 U8.12
  Bottom 0.127: v39.38,5.14 40.62,3.89 8B.1
A2  (via drill 0.2)
  Top 0.127: v41.75,22.02 41.75,17.02 U8.7 | v66.88,22.02 66.88,27.14 U6.P35
  Bottom 0.127: v41.75,22.02 53.25,22.02 53.38,22.14 56.5,22.14 56.62,22.02 v66.88,22.02
A2'  (via drill 0.2)
  Top 0.127: U3.1 24.62,31.77 v24.62,32.77 | v27.88,32.77 28.12,33.02 v28.12,45.14 | v32.15,49.1 32.88,49.83 v32.88,54.77 32.88,62.14 U2.10 | v61.62,50.77 61.62,49.64 61.5,49.52 U6.P85 | v45.5,53.73 45.52,53.73 45.52,51.03 v45.5,51.02
  Bottom 0.127: v27.88,32.77 v24.62,32.77 | v32.15,49.1 28.19,45.14 v28.12,45.14 | v61.62,50.77 61.12,50.27 47.5,50.27 46.75,51.02 v45.5,51.02 | v45.5,53.73 44.46,54.77 v32.88,54.77
A2_5  (via drill 0.2)
  Top 0.127: v41.88,5.14 41.88,11.14 U8.14
  Bottom 0.127: v41.88,5.14 43.12,3.89 9B.1
A3  (via drill 0.2)
  Top 0.127: v40.62,12.52 42.88,14.77 42.88,16.77 43,16.89 U8.5 | v16.5,11.64 12.5,15.64 12.5,26.02 12.38,26.14 12.38,34.14 v12.62,34.39 | v43.5,35.14 43.88,35.52 v43.88,36.27 | v53.88,35.27 54.88,34.27 v54.88,33.89 | v67.38,33.52 67.88,33.02 67.88,32.39 68.75,31.52 68.75,31.39 69,31.14 69.75,31.14 U6.P40
  Bottom 0.127: v40.62,12.52 39.75,11.64 v16.5,11.64 | v12.62,34.39 13,34.77 24.38,34.77 24.88,35.27 43.38,35.27 v43.5,35.14 | v43.88,36.27 52.5,36.27 53.5,35.27 v53.88,35.27 | v54.88,33.89 55.25,33.52 v67.38,33.52
A3'  (via drill 0.2)
  Top 0.127: U3.2 25.12,31.77 25.12,33.39 25.62,33.89 v25.62,39.77 | v30.12,46.02 v30.12,41.39 | v32.38,48.27 31.62,48.27 v31.62,51.77 31.62,62.14 U2.9 | v58.75,53.52 58.75,53.14 59.88,52.02 59.88,49.52 U6.P88 | v37.62,51.77 v37.62,53.14
  Bottom 0.127: v25.62,39.77 26.75,40.89 29.62,40.89 v30.12,41.39 | v32.38,48.27 v30.12,46.02 | v58.75,53.52 58.62,53.64 46.5,53.64 45.81,52.95 37.82,52.95 v37.62,53.14 | v31.62,51.77 v37.62,51.77
A3_5  (via drill 0.2)
  Top 0.127: v44.5,5.02 44.5,8.89 43.25,10.14 43.25,11.02 43.12,11.14 U8.16
  Bottom 0.127: v44.5,5.02 45.62,3.89 10B.1
A4  (via drill 0.2)
  Top 0.127: v70,18.89 70,17.14 69.88,17.02 U11.5 | v78.25,23.14 78.25,34.14 77.88,34.52 77.88,39.52 v77.38,40.02 | v72.62,41.14 72.25,41.52 72.25,44.39 71.12,45.52 69.88,45.52 U6.P69
  Bottom 0.127: v70,18.89 71.25,20.14 75.25,20.14 v78.25,23.14 | v77.38,40.02 76.88,40.52 74.88,40.52 74.75,40.39 74.25,40.39 73.5,41.14 v72.62,41.14
A4'  (via drill 0.2)
  Top 0.127: v25.5,27.52 25.5,31.52 U3.3 | v34.12,27.52 35.12,28.52 v35.12,29.52 | v56.5,29.64 56.5,45.64 57.5,46.64 57.5,49.39 U6.P93 | v30.38,51.77 30.38,62.14 U2.8 | v16.62,51.64 15,50.02 15,44.39 15.5,43.89 v15.5,28.14
  Bottom 0.127: v34.12,27.52 v25.5,27.52 16.12,27.52 v15.5,28.14 | v35.12,29.52 35.25,29.39 37,29.39 37.25,29.14 54.25,29.14 54.38,29.02 55.88,29.02 v56.5,29.64 | v30.38,51.77 30,51.39 24.38,51.39 24.12,51.64 v16.62,51.64
A4_5  (via drill 0.2)
  Top 0.127: v70.62,9.02 70.62,9.64 70,10.27 70,11.02 69.88,11.14 U11.16
  Bottom 0.127: v70.62,9.02 70.75,8.89 73.5,8.89 76.12,6.27 76.12,3.89 22B.1
A5  (via drill 0.2)
  Top 0.127: v76.75,43.39 76.88,43.27 76.88,39.77 76.75,39.64 76.75,29.39 76,28.64 76,17.64 74.12,15.77 74.12,14.77 70,14.77 68.75,16.02 68.75,16.77 68.62,16.89 U11.7 | v71.25,43.77 70.88,44.14 69.88,44.14 U6.P66
  Bottom 0.127: v76.75,43.39 76.38,43.77 v71.25,43.77
A5'  (via drill 0.2)
  Top 0.127: v26,26.89 26,31.52 U3.4 | v19.75,26.89 20,26.89 20.12,26.77 21.5,26.77 21.5,28.14 20.88,28.77 19,28.77 19,29.39 16.38,32.02 v16.38,41.89 | v19.5,42.27 20.62,43.39 20.62,47.27 22,48.64 v22,58.27 | v29.12,58.77 29.12,62.14 U2.7 | v55.75,58.64 55.75,52.64 56.38,52.02 56.38,49.52 U6.P95
  Bottom 0.127: v19.75,26.89 v26,26.89 | v16.38,41.89 16.75,42.27 v19.5,42.27 | v22,58.27 22.5,58.77 v29.12,58.77 38.62,58.77 39.12,58.27 40,58.27 40.25,58.52 41.62,58.52 41.88,58.27 49.5,58.27 49.75,58.52 55.62,58.52 v55.75,58.64
A5_5  (via drill 0.2)
  Top 0.127: v68.5,8.27 68.5,11.14 U11.14
  Bottom 0.127: v68.5,8.27 68.75,8.02 71.88,8.02 73.62,6.27 73.62,3.89 21B.1
A6  (via drill 0.2)
  Top 0.127: v44.62,34.64 44.62,34.02 43.85,33.24 43.85,32.43 43.76,32.34 43.76,31.94 44.12,31.57 44.12,24.58 43.38,23.84 43.38,23.8 43.25,23.67 43.25,19.39 43.5,19.14 43.5,17.14 43.62,17.02 U8.4 | v73.75,32.52 v73.75,35.39 | v71.62,31.64 69.88,31.64 U6.P41
  Bottom 0.127: v44.62,34.64 44.75,34.77 60.75,34.77 62.12,36.14 68.12,36.14 68.25,36.27 70.62,36.27 71.5,35.39 v73.75,35.39 | v73.75,32.52 72.88,31.64 v71.62,31.64
A6'  (via drill 0.2)
  Top 0.127: U3.5 26.62,31.77 26.62,43.52 23.5,46.64 v23.5,50.77 v23.5,60.14 | v27.75,60.52 27.75,62.14 U2.6 | v54.5,51.52 54.5,49.52 U6.P99
  Bottom 0.127: v23.5,60.14 23.88,60.52 v27.75,60.52 | v54.5,51.52 44.25,51.52 43.25,50.52 31.38,50.52 31.25,50.64 23.62,50.64 v23.5,50.77
A6_5  (via drill 0.2)
  Top 0.127: 47,12.39 47,10.02 48.25,8.77 48.25,3.89 11A.1 | 47,12.39 47,13.02 44.75,13.02 43.88,12.14 43.88,11.39 43.75,11.27 U8.17 | v72.38,5.14 72.5,5.27 72.5,10.02 72.88,10.39 72.88,12.27 71.62,13.52 v71.62,13.77 | 47,12.39 v46.88,12.39
  Bottom 0.127: v72.38,5.14 71.12,3.89 20B.1 | v71.62,13.77 71.25,14.14 62,14.14 61.5,13.64 56.38,13.64 55.12,12.39 v46.88,12.39
A7  (via drill 0.2)
  Top 0.127: v62.38,23.77 62.38,17.14 62.25,17.02 U10.3 | v72.62,24.64 74.5,26.52 74.5,32.14 74.75,32.39 74.75,37.02 v74.38,37.39 | v72.25,37.52 71.88,37.89 71.88,40.89 70.75,42.02 69.88,42.02 U6.P62
  Bottom 0.127: v62.38,23.77 63.25,24.64 v72.62,24.64 | v74.38,37.39 74.25,37.52 v72.25,37.52
A7'  (via drill 0.2)
  Top 0.127: v41.62,39.39 38.25,39.39 U3.38 | v53.38,39.39 53.38,49.39 U6.P101 53.5,49.52 53.62,49.64 53.62,57.27 v53.38,57.52 | v27.88,57.27 27.25,57.89 27.25,61.52 26.62,62.14 U2.5
  Bottom 0.127: v53.38,39.39 v41.62,39.39 | v27.88,57.27 28.12,57.02 39.25,57.02 39.75,57.52 v53.38,57.52
A7_5  (via drill 0.2)
  Top 0.127: v63.5,9.27 62.38,10.39 62.38,11.02 62.25,11.14 U10.18
  Bottom 0.127: v63.5,9.27 64.75,8.02 66.88,8.02 68.5,6.39 68.5,3.89 19B.1
A8  (via drill 0.2)
  Top 0.127: v60.88,24.77 60.88,17.02 U10.5 | v73,28.89 73.25,29.14 v73.25,40.64 | v71.25,40.64 70.88,41.02 69.88,41.02 U6.P60
  Bottom 0.127: v60.88,24.77 61.12,25.02 68.88,25.02 72.75,28.89 v73,28.89 | v71.25,40.64 v73.25,40.64
A8'  (via drill 0.2)
  Top 0.127: v30.88,45.52 30.88,37.64 33.12,37.64 33.38,37.89 33.38,39.77 38.12,39.77 U3.39 | v33.75,48.39 34.25,48.89 34.25,53.89 33.5,54.64 v33.5,58.27 33.5,76.27 33.25,76.52 27.88,76.52 27.88,75.27 U2.27 | v55.88,50.77 55.88,50.52 55.25,50.52 55.12,50.39 55.12,49.64 55,49.52 U6.P98 | v58.38,51.27 58.38,53.14 58.25,53.27 58.25,55.27 v58.38,55.39 | v37.62,55.27 37,55.89 v37,58.27
  Bottom 0.127: v33.75,48.39 v30.88,45.52 | v55.88,50.77 56.38,51.27 v58.38,51.27 | v58.38,55.39 58.25,55.27 47,55.27 46.88,55.14 37.75,55.14 v37.62,55.27 | v33.5,58.27 v37,58.27
A8_5  (via drill 0.2)
  Top 0.127: v64.75,5.14 64.75,8.39 62.5,8.39 61.12,9.77 61.12,11.02 61,11.14 U10.16
  Bottom 0.127: v64.75,5.14 66,3.89 18B.1
A9  (via drill 0.2)
  Top 0.127: v60.38,18.27 59.75,17.64 59.75,17.14 59.62,17.02 U10.7 | v64.88,25.89 v64.88,19.39 | v67.38,29.77 66.88,30.27 66.88,39.77 66.75,39.89 66.75,40.39 67.5,41.14 68.75,41.14 68.75,40.89 69,40.64 69.75,40.64 U6.P59
  Bottom 0.127: v60.38,18.27 61.5,19.39 v64.88,19.39 | v64.88,25.89 67.38,28.39 v67.38,29.77
A9'  (via drill 0.2)
  Top 0.127: v54.75,47.89 55.38,48.52 55.38,49.39 U6.P97 | U3.40 38.25,40.39 41.75,40.39 41.75,47.52 v41.62,47.64 41.62,48.14 v41.12,48.64 | v29.88,57.77 29.88,74.52 29.25,75.14 U2.26 | v38.38,57.52 38.5,57.39 v38.5,48.77
  Bottom 0.127: v41.62,47.64 52,47.64 52.25,47.89 v54.75,47.89 | v29.88,57.77 30.25,57.39 38.25,57.39 v38.38,57.52 | v38.5,48.77 38.62,48.64 v41.12,48.64
A9_5  (via drill 0.2)
  Top 0.127: v60.75,9.39 59.75,10.39 59.75,11.02 59.62,11.14 U10.14
  Bottom 0.127: v60.75,9.39 60.75,8.02 61.75,8.02 63.5,6.27 17B.1
A10  (via drill 0.2)
  Top 0.127: v58.5,18.64 58.5,17.14 58.38,17.02 U10.9 | v77.12,23.77 77.12,33.39 77.38,33.64 v77.38,38.02 | v67.38,39.14 67.25,39.27 v67.25,40.14 | v68.5,40.14 69,39.64 69.75,39.64 U6.P57
  Bottom 0.127: v58.5,18.64 60.12,20.27 69.12,20.27 69.38,20.52 73.88,20.52 v77.12,23.77 | v77.38,38.02 76.25,39.14 71.75,39.14 71.5,39.39 68.88,39.39 68.62,39.14 v67.38,39.14 | v68.5,40.14 v67.25,40.14
A10'  (via drill 0.2)
  Top 0.127: v34,45.02 35.62,43.39 35.62,40.77 38.12,40.77 U3.41 | v60.62,47.39 60.62,49.27 60.5,49.39 U6.P87 | v33,63.89 33,75.14 U2.23 | v34.12,63.89 34.75,63.27 34.75,54.77 34.5,54.52 34.5,54.02 34.62,53.89 34.62,48.39 v34.5,48.27
  Bottom 0.127: v34,45.02 33.5,45.52 33.5,47.77 34.5,47.77 | 34.5,47.77 36.75,47.77 38.25,49.27 43.12,49.27 43.75,48.64 47.25,48.64 47.5,48.39 55.75,48.39 56.12,48.02 59.38,48.02 60,47.39 v60.62,47.39 | v34.12,63.89 v33,63.89 | 34.5,47.77 v34.5,48.27
A10_5  (via drill 0.2)
  Top 0.127: v58.5,8.77 58.5,11.02 58.38,11.14 U10.12
  Bottom 0.127: v58.5,8.77 60.88,6.39 60.88,3.89 16B.1
A11  (via drill 0.2)
  Top 0.127: v52,20.39 53.12,19.27 53.12,17.14 53.25,17.02 U9.3 | v65.88,37.14 v65.88,30.39 | v67.62,37.14 69,38.52 69.75,38.52 U6.P55
  Bottom 0.127: v52,20.39 53.38,21.77 56.5,21.77 56.62,21.64 66.5,21.64 66.62,21.52 74.12,21.52 81.12,28.52 81.12,30.27 66,30.27 v65.88,30.39 | v67.62,37.14 v65.88,37.14
A11'  (via drill 0.2)
  Top 0.127: v40,46.52 40,41.39 38.25,41.39 U3.42 | v57,46.89 57,49.39 U6.P94 57,49.52 57,55.39 v56.62,55.77 | v31.62,68.89 31.62,70.64 31.12,71.14 31.12,74.52 30.5,75.14 U2.25 | v46.38,65.89 46.75,65.52 46.75,62.77 47.38,62.14 v47.38,56.27
  Bottom 0.127: v40,46.52 40.12,46.64 45.75,46.64 46,46.89 v57,46.89 | v31.62,68.89 31.75,69.02 41.5,69.02 44.62,65.89 v46.38,65.89 | v47.38,56.27 47.88,55.77 v56.62,55.77
A11_5  (via drill 0.2)
  Top 0.127: v53.5,8.39 53.5,11.02 53.38,11.14 U9.18
  Bottom 0.127: v53.5,8.39 53.88,8.02 56.62,8.02 58.38,6.27 58.38,3.89 15B.1
A12  (via drill 0.2)
  Top 0.127: v51,18.52 51.88,17.64 51.88,17.14 52,17.02 U9.5 | v49.38,18.77 49.25,18.89 v49.25,27.14 | v64.38,34.14 v64.38,30.64 | v68.5,35.77 68.75,35.77 69,36.02 69.75,36.02 U6.P50
  Bottom 0.127: v51,18.52 50.75,18.77 v49.38,18.77 | v49.25,27.14 49.38,27.27 65,27.27 66.88,29.14 66.88,29.89 65.12,29.89 v64.38,30.64 | v64.38,34.14 64.38,35.77 v68.5,35.77
A12'  (via drill 0.2)
  Top 0.127: v51.75,56.77 52.12,56.39 52.12,49.64 52,49.52 U6.P104 | U3.43 38.25,41.89 39.5,41.89 39.5,51.39 39.38,51.52 39.38,55.89 39.75,56.27 v39.75,56.77 39.75,56.89 v38.38,58.27 | v25.38,58.27 25.38,62.14 U2.4
  Bottom 0.127: v51.75,56.77 v39.75,56.77 | v25.38,58.27 32.75,58.27 33.25,57.77 37.88,57.77 v38.38,58.27
A12_5  (via drill 0.2)
  Top 0.127: v52.25,9.77 52.25,11.02 52.12,11.14 U9.16 | v54.12,8.89 54.62,8.39 v54.62,5.14
  Bottom 0.127: v52.25,9.77 53.12,8.89 v54.12,8.89 | v54.62,5.14 55.88,3.89 14B.1
A13  (via drill 0.2)
  Top 0.127: v50.5,20.27 50.5,17.14 50.62,17.02 U9.7 | v46.62,21.02 46.62,27.14 46.38,27.39 v46.38,28.02 | v65.62,29.39 65.38,29.64 v65.38,34.89 | v68.5,35.02 68.88,34.64 69.75,34.64 U6.P47
  Bottom 0.127: v50.5,20.27 49.75,21.02 v46.62,21.02 | v46.38,28.02 64.25,28.02 v65.62,29.39 | v65.38,34.89 65.5,35.02 v68.5,35.02
A13'  (via drill 0.2)
  Top 0.127: v36.12,41.27 36.12,42.27 38.12,42.27 U3.44 | v35.12,41.27 35,41.14 v35,40.27 | v54,41.14 54,49.39 U6.P100 54,49.52 v54,69.39 | v27.38,69.14 27.38,74.39 26.62,75.14 U2.28
  Bottom 0.127: v35.12,41.27 v36.12,41.27 | v35,40.27 35.12,40.39 53,40.39 53.75,41.14 v54,41.14 | v27.38,69.14 27.62,69.39 v54,69.39
A13_5  (via drill 0.2)
  Top 0.127: v52.12,5.02 52.12,7.52 50.88,8.77 50.88,11.02 50.75,11.14 U9.14
  Bottom 0.127: v52.12,5.02 53.25,3.89 13B.1
A14  (via drill 0.2)
  Top 0.127: v49.62,15.14 49.62,16.77 49.5,16.89 U9.9 | v56.5,15.02 56.25,15.27 v56.25,21.27 | v72.12,21.02 72.12,32.27 70.88,33.52 69.88,33.52 U6.P45
  Bottom 0.127: v49.62,15.14 49.75,15.02 v56.5,15.02 | v56.25,21.27 66.5,21.27 66.75,21.02 v72.12,21.02
A14'  (via drill 0.2)
  Top 0.127: 35.5,44.52 35.38,44.64 v35.38,46.02 | 35.5,44.52 36,44.02 36,42.89 38.12,42.89 U3.45 | v46.25,46.39 46.62,46.02 47.62,46.02 U6.P111 | v24,53.89 24,62.14 U2.3 | v37,53.77 37.12,53.64 37.12,46.14 35.5,44.52
  Bottom 0.127: v35.38,46.02 35.88,46.52 37.75,46.52 38.25,46.02 40.25,46.02 40.5,46.27 46.12,46.27 v46.25,46.39 | v24,53.89 24.12,53.77 v37,53.77
A14_5  (via drill 0.2)
  Top 0.127: v49.62,9.27 49.62,11.02 49.5,11.14 U9.12
  Bottom 0.127: v49.62,9.27 50.75,8.14 50.75,3.89 12B.1
A15  (via drill 0.2)
  Top 0.127: v44.25,32.14 44.38,32.02 44.38,17.02 U8.3 | v68.38,33.02 68.75,32.64 69.75,32.64 U6.P43
  Bottom 0.127: v44.25,32.14 48.62,32.14 48.75,32.02 63.75,32.02 64.75,33.02 v68.38,33.02
A15'  (via drill 0.2)
  Top 0.127: v37.12,43.39 38.12,43.39 U3.46 | v45.62,44.02 45.75,44.14 45.75,44.89 46.38,45.52 47.62,45.52 U6.P112 | v23.5,73.14 23.5,74.52 22.88,75.14 U2.31 | v39.75,70.39 40.12,70.02 40.12,59.14 40.25,59.02 40.25,56.39 39.88,56.02 v39.88,51.77 | v43.29,44.04 43.29,51.25 v43.26,51.29
  Bottom 0.127: v37.12,43.39 37.77,44.04 v43.29,44.04 45.61,44.04 v45.62,44.02 | v23.5,73.14 26.25,70.39 v39.75,70.39 | v39.88,51.77 40.35,51.29 v43.26,51.29
A15_5  (via drill 0.2)
  Top 0.127: v47,5.14 47,7.52 44.62,9.89 44.62,11.02 44.5,11.14 U8.18
  Bottom 0.127: v47,5.14 48.25,3.89 11B.1
A16'  (via drill 0.2)
  Top 0.127: v39,56.27 39,51.52 39.12,51.39 39.12,44.64 39,44.52 39,44.39 38.25,44.39 U3.48 | v23,56.14 22.88,56.27 22.88,62.14 U2.2 | v46.25,44.64 47.62,44.64 U6.P114 | v45.25,45.02 45.75,45.52 45.75,50.52 46,50.77 46,56.14 v46.12,56.27
  Bottom 0.127: v23,56.14 23.12,56.27 v39,56.27 v46.12,56.27 | v46.25,44.64 45.88,45.02 v45.25,45.02
A17'  (via drill 0.2)
  Top 0.127: 36.5,52.77 36.5,60.77 36,61.27 36,64.02 v34,66.02 | 36.5,52.77 36.5,47.14 U3.51 | v25.38,66.64 24.12,67.89 24.12,75.14 U2.30 | v67.75,44.39 67.75,41.64 69.75,41.64 U6.P61 | v73.25,49.64 v73.25,45.39 | v47.12,49.89 46.88,50.14 v46.88,52.77 | 36.5,52.77 v36.62,52.77
  Bottom 0.127: v34,66.02 33.38,66.64 v25.38,66.64 | v67.75,44.39 68.75,45.39 v73.25,45.39 | v73.25,49.64 73.12,49.52 69.12,49.52 68.88,49.27 56,49.27 55.38,49.89 v47.12,49.89 | v46.88,52.77 46.75,52.64 36.75,52.64 v36.62,52.77
A18'  (via drill 0.2)
  Top 0.127: v36.12,46.02 36.12,46.89 36,47.02 U3.52 36,47.14 v36,53.27 | v49,44.52 48.62,44.14 47.75,44.14 U6.P115 | v21.5,53.89 21.5,62.14 U2.1
  Bottom 0.127: v36.12,46.02 36.38,45.77 37.62,45.77 37.75,45.64 40.25,45.64 40.5,45.89 47.62,45.89 v49,44.52 | v21.5,53.89 22,53.39 35.88,53.39 v36,53.27
B0  (via drill 0.2)
  Top 0.127: v34.62,45.52 34.62,46.89 34.5,47.02 U3.55 | v41.25,43.52 v41.25,45.39 | v46.25,43.52 47.62,43.52 U6.P116
  Bottom 0.127: v34.62,45.52 34.75,45.39 37.62,45.39 37.75,45.27 40.25,45.27 40.38,45.39 v41.25,45.39 | v46.25,43.52 v41.25,43.52
B1  (via drill 0.2)
  Top 0.127: v34,46.02 34,47.02 U3.56 | v44.88,48.14 44.75,48.02 44.75,44.14 45.88,43.02 47.62,43.02 U6.P117
  Bottom 0.127: v34,46.02 35.38,47.39 38.88,47.39 39.62,48.14 v44.88,48.14
B2  (via drill 0.2)
  Top 0.127: v33.5,42.14 33.5,47.02 U3.57 | v46.25,42.14 46.62,42.52 47.62,42.52 U6.P118
  Bottom 0.127: v46.25,42.14 v33.5,42.14
B3  (via drill 0.2)
  Top 0.127: v32.75,42.14 33.12,42.52 33.12,46.89 33,47.02 U3.58 | v49,41.64 48.62,42.02 47.75,42.02 U6.P119
  Bottom 0.127: v32.75,42.14 33.25,41.64 34.75,41.64 34.88,41.77 45.88,41.77 46,41.64 v49,41.64
B4  (via drill 0.2)
  Top 0.127: v32.62,44.02 32.62,46.89 32.5,47.02 U3.59 | v44.88,43.02 45.75,42.14 45.75,41.89 46,41.64 47.62,41.64 U6.P120
  Bottom 0.127: v32.62,44.02 33.62,43.02 36.75,43.02 36.88,42.89 44.75,42.89 v44.88,43.02
B5  (via drill 0.2)
  Top 0.127: v32,42.14 32,47.02 U3.60 | v46.25,41.02 47.62,41.02 U6.P121
  Bottom 0.127: v32,42.14 33.38,40.77 37.38,40.77 37.62,41.02 v46.25,41.02
B6  (via drill 0.2)
  Top 0.127: v31.38,40.27 31.38,47.02 U3.61 | v46.25,39.89 46.62,39.89 46.75,40.02 47.62,40.02 U6.P123
  Bottom 0.127: v31.38,40.27 31.88,39.77 41.25,39.77 41.38,39.89 v46.25,39.89
B7  (via drill 0.2)
  Top 0.127: U3.62 31.12,47.27 v31.12,49.39 | v44.72,49.61 44.38,49.27 44.38,40.89 46,39.27 46.62,39.27 46.62,39.39 46.75,39.52 47.62,39.52 U6.P124
  Bottom 0.127: v31.12,49.39 31.34,49.61 v44.72,49.61
BAT  (via drill 0.2)
  Top 0.127: v30.88,20.39 30.88,28.02 31.88,29.02 31.88,31.52 U3.16 | v28.25,18.64 26.88,20.02 26.88,21.14 26.38,21.64 D3.2
  Bottom 0.127: v30.88,20.39 28.88,18.39 28.25,18.39 | 28.25,18.39 26.75,18.39 BT1.P | 28.25,18.39 v28.25,18.64
BOOT0
  Top 0.127: R24.1 22.38,27.52 22.38,28.02 20.88,29.52 R30.2 20.75,29.64 20.75,36.27 22.62,36.27 U3.94
BRIGHT  (via drill 0.2)
  Top 0.127: R35.1 53.38,22.52 54.25,22.52 R34.1 54.38,22.52 55.25,22.52 R33.1 55.38,22.52 55.75,22.14 55.75,14.77 56.38,14.14 v56.38,10.89 | v39.12,10.64 39.12,22.39 v41.62,24.89 | v56.25,24.89 55.88,25.27 55.88,26.02 55.75,26.14 55.12,26.14 55.12,27.02 55,27.14 U6.P11
  Bottom 0.127: v56.38,10.89 56.25,11.02 48.38,11.02 48,10.64 v39.12,10.64 | v41.62,24.89 45.25,24.89 45.88,24.27 50,24.27 50.62,24.89 v56.25,24.89
CFG_CLK  (via drill 0.2)
  Top 0.127: v40.25,37.77 38.25,37.77 U3.35 | v57.5,37.52 57.88,37.14 57.88,27.27 U6.P17
  Bottom 0.127: v40.25,37.77 40.5,38.02 48.62,38.02 48.75,37.89 54.12,37.89 54.5,37.52 v57.5,37.52
CFG_DATA  (via drill 0.2)
  Top 0.127: v20.25,30.89 20.38,31.02 20.38,38.89 22.62,38.89 U3.89 | v57,30.64 57,27.27 U6.P15
  Bottom 0.127: v20.25,30.89 27.25,30.89 27.38,31.02 40.69,31.02 41.09,30.61 56.97,30.61 v57,30.64
CFG_RESET  (via drill 0.2)
  Top 0.127: v41.25,37.14 41.25,38.27 38.25,38.27 U3.36 | v57,36.89 57.5,36.39 57.5,27.27 U6.P16
  Bottom 0.127: v41.25,37.14 41.38,37.27 48.62,37.27 48.75,37.14 52.38,37.14 52.62,36.89 v57,36.89
COMPOSITE
  Top 0.127: R4.1 64,82.39 57.12,82.39 57.12,79.89 X1.19
  Bottom 0.127: X1.19 57,79.77 54.88,77.64 9.62,77.64 9.38,77.89 X2.2
CS_LLS
  Top 0.127: R21.2 15.88,55.77 15.38,55.27 15.38,50.77 14.62,50.02 14.62,44.39 14.88,44.14 14.88,43.64 12.88,41.64 MICRO_SD1.2
CSYNC  (via drill 0.2)
  Top 0.127: v54.62,29.52 54.62,27.39 54.5,27.27 U6.P10 | v60.12,48.02 v60.12,30.14 | v68.12,48.02 67.88,48.27 67.88,54.14 66.75,55.27 66.75,59.39 68.62,61.27 68.62,63.27 69,63.64 71,63.64 71,63.77 71.12,63.89 71.12,67.64 | 71.12,67.64 71.12,68.39 70.25,69.27 69.88,69.27 U1.16 | 71.12,67.64 v71.38,67.64
  Bottom 0.127: v54.62,29.52 55.25,30.14 v60.12,30.14 | v68.12,48.02 v60.12,48.02 | v71.38,67.64 77.25,67.64 77.5,67.89 SJ1.1
CTRL_CLK  (via drill 0.2)
  Top 0.127: v21.62,38.39 22.62,38.39 U3.90 | v19.5,39.39 v19.5,38.39 | v5.75,45.02 5.88,45.14 v5.88,70.14 | v78.25,46.77 77.75,46.27 v77.75,43.27 | v54.38,39.14 53.38,38.14 53.38,28.89 52.5,28.02 52.5,27.27 U6.P6
  Bottom 0.127: v19.5,38.39 v21.62,38.39 | v19.5,39.39 19.25,39.64 8,39.64 7.25,40.39 5.5,40.39 5.25,40.64 5.25,45.02 v5.75,45.02 | v5.88,70.14 12.88,77.14 69.25,77.14 72.88,73.52 74.25,73.52 75.62,72.14 76.88,72.14 80.25,68.77 80.25,58.77 79.75,58.77 78.25,57.27 v78.25,46.77 | v77.75,43.27 76.12,41.64 57,41.64 54.5,39.14 v54.38,39.14
D0  (via drill 0.2)
  Top 0.127: v30.12,10.64 30.12,12.02 32,13.89 32,16.77 32.12,16.89 U7.8 | v77,10.39 79.62,13.02 v79.62,35.52 | v62.38,37.64 61.75,37.02 61.75,30.52 61,29.77 61,27.27 U6.P23 | v36.5,63.89 36.5,62.52 36.75,62.27 U2.13 | v20,63.02 19.5,62.52 19.5,47.64 19.62,47.52 19.62,44.64 19.75,44.52 19.75,43.27 19,42.52 19,33.89 19.25,33.64 19.25,33.14 v17.62,31.52 | v13,24.14 14.25,22.89 14.25,15.27 v18.88,10.64
  Bottom 0.127: v77,10.39 56.12,10.39 55.88,10.64 48.75,10.64 47.25,9.14 39.88,9.14 38.62,10.39 30.38,10.39 v30.12,10.64 v18.88,10.64 | v79.62,35.52 78.75,36.39 70.88,36.39 69.62,37.64 v62.38,37.64 | v36.5,63.89 36,64.39 21.38,64.39 v20,63.02 | v17.62,31.52 17.5,31.39 10.12,31.39 9.5,30.77 9.5,24.14 v13,24.14
D0_5
  Top 0.127: U7.13 32.12,11.14 32,11.02 32,5.39 30.5,3.89 4A.1
D1  (via drill 0.2)
  Top 0.127: v35.38,25.52 34.38,24.52 34.38,20.14 33.12,18.89 33.12,17.14 33,17.02 U7.7 32.88,16.89 32.88,14.02 v32,13.14 | v61.88,25.89 62.38,26.39 62.38,27.14 U6.P26 | v38,63.89 38,62.27 U2.14 | v22.12,63.64 21,63.64 v21,49.27 | v7.25,47.27 6.75,46.77 6.75,40.14 v7,39.89 | v7,39.02 6.75,38.77 v6.75,26.14 | v15.12,20.77 15.5,20.39 15.5,15.52 v17.88,13.14
  Bottom 0.127: v35.38,25.52 36.25,26.39 45.75,26.39 45.88,26.27 61.5,26.27 v61.88,25.89 | v38,63.89 37.5,63.39 22.38,63.39 v22.12,63.64 | v21,49.27 20.88,49.39 9.38,49.39 v7.25,47.27 | v7,39.02 v7,39.89 | v6.75,26.14 9.12,23.77 12.12,23.77 v15.12,20.77 | v32,13.14 v17.88,13.14
D1_5
  Top 0.127: U7.14 33,11.14 33,3.89 5A.1
D2  (via drill 0.2)